# Altium project panel.PrjPcb
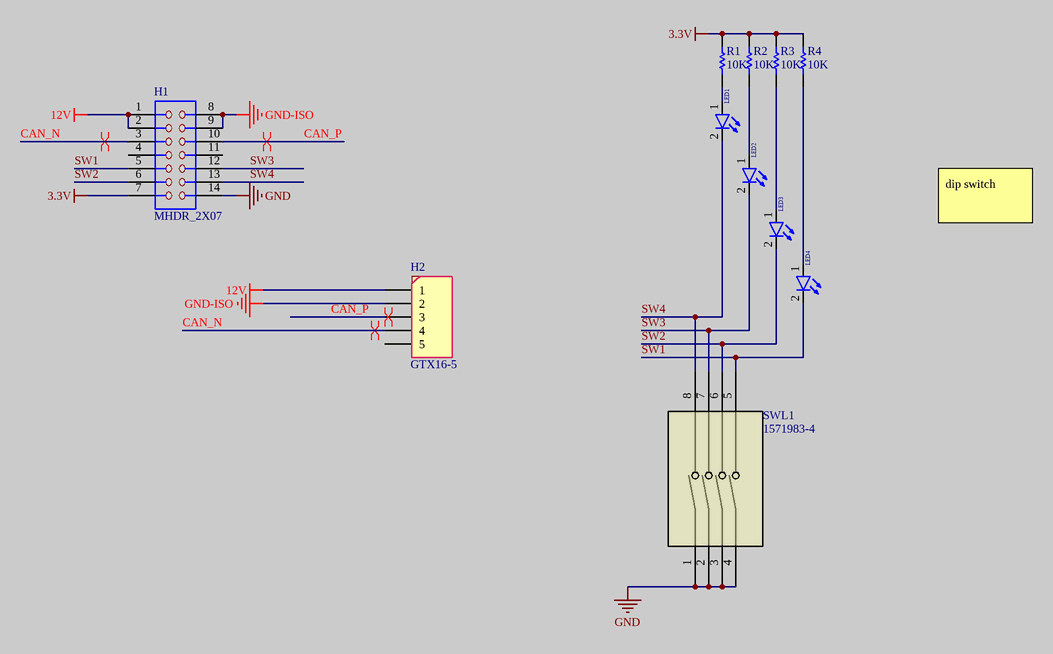
[diagram p0: panel.SchDoc]
1 sheet, 11 parts. Net scope: global (net labels, ports and power ports of the same name join across sheets).
Board file: panel.PcbDoc

## Sheet panel.SchDoc
size A; SheetNumber: 1; SheetTotal: 1

### Parts
H1  MHDR_2X07  [miniATX 2 × 7]
H2  GTX16-5  [GX16-5PIN]
LED1  Red  [LED 3mm]  (value not drawn)
LED2  Red  [LED 3mm]  (value not drawn)
LED3  Red  [LED 3mm]  (value not drawn)
LED4  Red  [LED 3mm]  (value not drawn)
R1  10K  [RES0603]
R2  10K  [RES0603]
R3  10K  [RES0603]
R4  10K  [RES0603]
SWL1  1571983-4  [SW4_1571983_4P_TEC]

### Nets
3.3V: H1.7 R1.2 R2.2 R3.2 R4.2
12V: H1.1 H1.2 H2.1
GND: H1.14 SWL1.1 SWL1.2 SWL1.3 SWL1.4
GND-ISO: H1.8 H1.9 H2.2
CAN_N: H1.3 H2.4
CAN_P: H1.10 H2.3
SW1: H1.5 LED4.2(K) SWL1.5
SW2: H1.6 LED3.2(K) SWL1.6
SW3: H1.12 LED2.2(K) SWL1.7
SW4: H1.13 LED1.2(K) SWL1.8
NetLED1_1: LED1.1(A) R1.1
NetLED2_1: LED2.1(A) R2.1
NetLED3_1: LED3.1(A) R3.1
NetLED4_1: LED4.1(A) R4.1

Not connected (* = marked no-connect by the designer): H1 4 11; H2 5

### Layout directives
differential pair: CAN_N, CAN_P

### Notes on the sheet
- dip switch

### Library data of the parts
H1 = HDR_mini_2 × 7: Male Header 2X07
H2 = Header1*5: LatestRevisionDate: 17-Jul-2002; LatestRevisionNote: Re-released for DXP Platform.; Publisher: Altium Limited
LED1-LED4 = LED: Designer: Saeid Jorablo; Organazation: ControTec; Adding Date: 1387/12/22; Color: Red; Size: SMD 0603
R1-R4 = Resistor: 0603,0.1W; Published: 8-Jun-2000; LatestRevisionDate: 17-Jul-2002; LatestRevisionNote: Re-released for DXP Platform.; PackageReference: AXIAL-0.5; Publisher: Altium Limited; Value: 10K
SWL1 = 1571983-4: GDH04S04=DIP SWITCH; Manufacturer_Name: TE Connectivity; Copyright: Copyright (C) 2025 Ultra Librarian. All rights reserved.; Manufacturer_Part_Number: 1571983-4; RefDes: RefDes; Type: Type